# EAGLE design sep_boards_V4 (EAGLE 9.0.1)
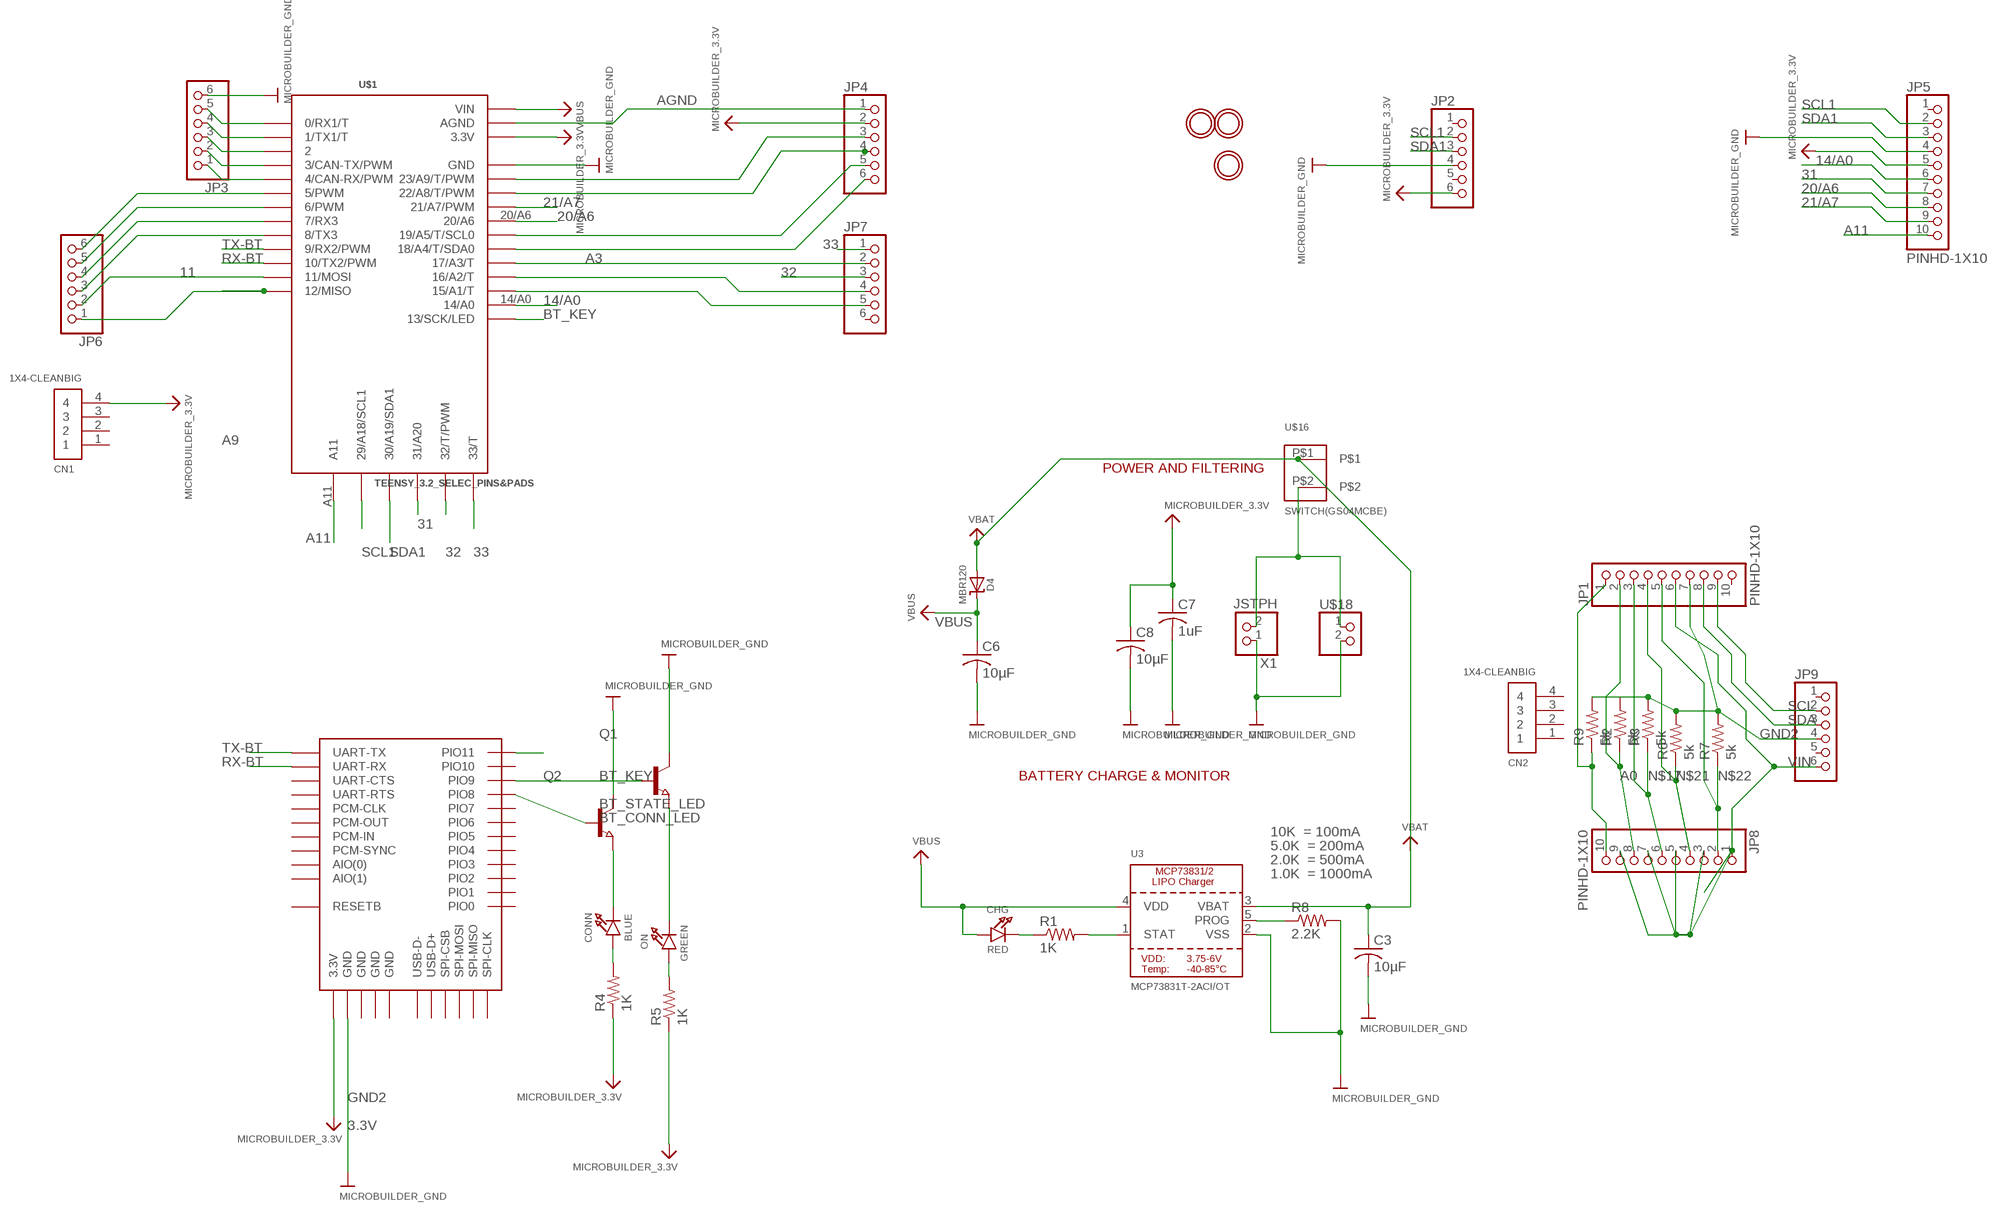
[diagram p0: schematic, sheet 1]

## Parts
C3  10µF  C-USC0805  [C0805]
C6  10µF  C-USC0805  [C0805]
C7  1uF  C-USC0805  [C0805]
C8  10µF  C-USC0805  [C0805]
CHG  RED  LED0805_NOOUTLINE  [CHIPLED_0805_NOOUTLINE]
CN1  1X4-CLEANBIG  [1X04-CLEANBIG]
CN2  1X4-CLEANBIG  [1X04-CLEANBIG]
CONN  BLUE  LED0805_NOOUTLINE  [CHIPLED_0805_NOOUTLINE]
D4  MBR120  DIODE-SCHOTTKYSOD-123  [SOD-123]
JP1  PINHD-1X10  [1X10-BIG]
JP2  PINHD-1X6CLEAN  [1X06-CLEAN]
JP3  PINHD-1X6B  [1X06-BIG]
JP4  PINHD-1X6B  [1X06-BIG]
JP5  PINHD-1X10  [1X10-BIG]
JP6  PINHD-1X6B  [1X06-BIG]
JP7  PINHD-1X6B  [1X06-BIG]
JP8  PINHD-1X10  [1X10-BIG]
JP9  PINHD-1X6CB  [1X06-CLEANBIG]
ON  GREEN  LED0805_NOOUTLINE  [CHIPLED_0805_NOOUTLINE]
Q1  NPN-TRANSISTOR_SOT23  [SOT23]
Q2  NPN-TRANSISTOR_SOT23  [SOT23]
R1  1K  R-US_M0805  [M0805]
R2  5k  R-US_M0805  [M0805]
R3  5k  R-US_M0805  [M0805]
R4  1K  R-US_M0805  [M0805]
R5  1K  R-US_M0805  [M0805]
R6  5k  R-US_M0805  [M0805]
R7  5k  R-US_M0805  [M0805]
R8  2.2K  R-US_M0805  [M0805]
R9  5k  R-US_M0805  [M0805]
U3  MCP73831T-2ACI/OT  MCP73831/2  [SOT23-5]
U$1  TEENSY_3.2_SELEC_PINS&PADS  [TEENSY_3.0-3.2SELEC_PINS&_PADS]
U$2  BTM400_6B  [BTM400_6B]
U$16  SWITCH(GS04MCBE)  [SWITCH(GS04MCBE)]
U$18  PINHD-1X2  [1X02]
U$22  MOUNTINGHOLE2.5  [MOUNTINGHOLE_2.5_PLATED]
U$23  MOUNTINGHOLE2.5  [MOUNTINGHOLE_2.5_PLATED]
U$32  MOUNTINGHOLE2.5  [MOUNTINGHOLE_2.5_PLATED]
X1  JSTPH  CON_JST_PH_2PIN  [JSTPH2]

## Nets
3.3V: C7.1 C8.1 CN1.4 JP2.6 JP4.2 JP5.5 R4.1 R5.1 U$1.3.3V U$2.3.3V ; supply symbol labelled MICROBUILDER_3.3V
11: JP6.2 U$1.11(11/MOSI)
14/A0: JP5.6 U$1.14/A0
20/A6: JP5.8 U$1.20/A6
21/A7: JP5.9 U$1.21/A7(21/A7/PWM)
31: JP5.7 U$1.31(31/A20)
32: JP7.3 U$1.32(32/T/PWM)
33: JP7.1 U$1.33(33/T)
A0: JP1.2 JP8.8 R2.1
A3: JP7.2 U$1.17/A3(17/A3/T)
A8: JP4.4 U$1.22/A8(22/A8/T/PWM)
A9: JP4.3 U$1.23/A9(23/A9/T/PWM)
A11: JP5.10 U$1.A11
AGND: JP4.1 U$1.AGND
BT_CONN_LED: Q2.1(B) U$2.PIO(8)(PIO8)
BT_KEY: U$1.13(13/SCK/LED) U$2.PIO(11)(PIO11)
BT_STATE_LED: Q1.1(B) U$2.PIO(9)(PIO9)
GND2: C3.2 C6.2 C7.2 C8.2 JP1.7 JP2.4 JP3.6 JP5.4 JP9.4 Q1.3(C) Q2.3(C) R2.2 R3.2 R6.2 R7.2 R8.2 R9.2 U3.2(VSS) U$1.GND U$2.GND@1(GND) U$18.2 X1.1 ; supply symbol labelled MICROBUILDER_GND
N$1: CONN.A R4.2
N$2: ON.A R5.2
N$3: JP3.1 U$1.4(4/CAN-RX/PWM)
N$4: JP3.2 U$1.3(3/CAN-TX/PWM)
N$5: ON.C Q1.2(E)
N$6: CONN.C Q2.2(E)
N$7: JP3.3 U$1.2
N$8: JP3.4 U$1.1(1/TX1/T)
N$9: JP3.5 U$1.0(0/RX1/T)
N$10: JP7.4 U$1.16/A2(16/A2/T)
N$11: JP6.6 U$1.5(5/PWM)
N$12: JP6.5 U$1.6(6/PWM)
N$13: JP6.4 U$1.7(7/RX3)
N$14: JP6.3 U$1.8(8/TX3)
N$15: JP6.1 U$1.12(12/MISO)
N$16: JP1.1 JP8.10 R9.1
N$17: JP1.3 JP8.6 R3.1
N$18: JP4.5 U$1.19/A5(19/A5/T/SCL0)
N$19: JP4.6 U$1.18/A4(18/A4/T/SDA0)
N$20: JP7.5 U$1.15/A1(15/A1/T)
N$21: JP1.4 JP8.4 R6.1
N$22: JP1.5 JP8.2 R7.1
N$52: CHG.C R1.1
N$53: R1.2 U3.1(STAT)
N$54: R8.1 U3.5(PROG)
RX-BT: U$1.10(10/TX2/PWM) U$2.UART-RX
SCL: JP1.9 JP9.2
SCL1: JP2.2 JP5.2 U$1.29(29/A18/SCL1)
SDA: JP1.8 JP9.3
SDA1: JP2.3 JP5.3 U$1.30(30/A19/SDA1)
TX-BT: U$1.9(9/RX2/PWM) U$2.UART-TX
VBAT: U$16.P$2 U$18.1 X1.2
VBAT2: C3.1 D4.A U3.3(VBAT) U$16.P$1 ; supply symbol labelled VBAT
VBUS: C6.1 CHG.A D4.C U3.4(VDD) U$1.VIN
VIN: JP1.6 JP8.1 JP8.3 JP8.5 JP8.7 JP8.9 JP9.6
Unconnected: CN1.1 CN1.2 CN1.3 CN2.1 CN2.2 CN2.3 CN2.4 JP1.10 JP2.1 JP2.5 JP5.1 JP7.6 JP9.1 JP9.5 U$2.AIO(0) U$2.AIO(1) U$2.PCM-CLK U$2.PCM-IN U$2.PCM-OUT U$2.PCM-SYNC U$2.PIO(0)(PIO0) U$2.PIO(1)(PIO1) U$2.PIO(2)(PIO2) U$2.PIO(3)(PIO3) U$2.PIO(4)(PIO4) U$2.PIO(5)(PIO5) U$2.PIO(6)(PIO6) U$2.PIO(7)(PIO7) U$2.PIO(10)(PIO10) U$2.RESETB U$2.SPI-CLK U$2.SPI-CSB U$2.SPI-MISO U$2.SPI-MOSI U$2.UART-CTS U$2.UART-RTS U$2.USB-D+ U$2.USB-D-

## Notes on the sheet
- POWER AND FILTERING
- BATTERY CHARGE & MONITOR
- 10K  = 100mA
- 5.0K  = 200mA
- 2.0K  = 500mA
- 1.0K  = 1000mA

## Power pins joined to a net without a drawn wire
GND2: U$2.GND@2(GND) U$2.GND@3(GND) U$2.GND@4(GND)

## Library data of the parts
C3 C6-C8 = adafruit:C-US: CAPACITOR, American symbol
CHG CONN ON = microbuilder:LED: LED 0603 - 0603 Surface Mount Package 2mA: Green LED - Low Power (3.9mcd, 2ma, 1.7Vf) - Digikey: 475-2709-2-ND Orange LED - Low Power (9.8mcd, 2ma, 1.8Vf) - Digikey: 475-1194-2-ND Red LED - Low Power (5mcd, 2ma, 1.8Vf) - Digikey: 475-1195-2-ND Yellow LED - Low Power (7mcd, 2ma, 1.8Vf) - Digikey: 475-1196-2-ND 5mA: Blue LED - Low Power (17mcd, 5ma, 2.9Vf) - Digikey: LNJ937W8CRACT-ND 0805 - 0805 Surface Mount Package 2mA: Red LED (8.8mcd, 2mA, 1.8Vf, Clear) - Low Power [Digikey: 475-2510-1-ND] Green LED (5mcd, 2mA, 1.8Vf, Clear) - Low Power [Digikey: 475-2730-1-ND] Yellow LED (11.3mcd, 2mA, 1.8Vf, Clear) - Low Power [Digikey: 475-2555-1-ND] 20mA: Red LED (104mcd, 20mA, Diffused) - LS R976 [Digikey: 475-1278-6-ND] Red LED (12mcd, 20mA, 2.0Vf, Clear) - APT2012EC [Digikey: 754-1128-1-ND] Green LED (15mcd, 20mA, 2.2Vf, Clear) - APT2012GC [Digikey: 754-1131-1-ND] Orange LED (160mcd, 20mA, 2.1Vf, Clear) - APT2012SECK [Digikey: 754-1130-1-ND] 1206 - 1206 Surface Mount Package Green LED (26mcd, 20mA, Diffused) - LG N971 [Digikey: 475-1407-6-ND] Red LED (15mcd, 20mA, Diffused) - LH N974 [Digikey: 475-1416-6-ND] Cree - Cree High-Power Surface Mount LEDs XPEBWT-L1-0000-00D50 - White 111lm 350mA 2.9Vf 6200K 110° XTEAWT-00-0000-00000LEE3 - White 114lm 350mA 2.85Vf 5000K 115° Everlight - Everlight 45-21 Series Surface Mount LEDs 45-21/QK2C-B2832AC2CB2/2T - Warm White 2000mcd 20mA 3.25Vf 3050K 120° 45-21/LK2C-B38452C4CB2/2T - Nuetral White 2000mcd 20mA 3.25Vf 4150K 120° 45-21/LK2C-B50634C6CB2/2T - Cold White 2200mcd 20mA 3.25Vf 5650K 120° PLCC2 Reverse Mount LS T77K-J1L2-1-0-2-R18-Z - Red 11.25mcd 2mA 1.8Vf 630nm 120° LO T77K-L1M2-24-Z - Orange 19.6mcd 2mA 1.8Vf 606nm 120° LY T77K-K2M1-26-Z - Yellow 15.7mcd 2mA 1.8Vf 587nm 120°
CN1 CN2 = adafruit:1X4: 4-pin connector
D4 = microbuilder:DIODE-SCHOTTKY
JP1 JP5 JP8 = adafruit:PINHD-1X10: Pin header 1x10 0.1" spacing With round pins
JP2-JP4 JP6 JP7 JP9 = adafruit:PINHD-1X6: PIN HEADER
Q1 Q2 = semicon-smd-ipc:NPN-TRANSISTOR_: NPN TRANSISTOR
R1-R9 = adafruit:R-US_: RESISTOR, American symbol
U3 = microbuilder:MCP73831/2: MCP73831/2 LIPO Charger VDD: 3.75 - 6V Temp -40 - 85°C Programmable Charge Rate: 15-500mA NOTE: STAT is a tri-state logic output on the MCP73831 and an open-drain output on the MCP73832. SOT23-5 with 4.2V output and tri-state logic on STAT = MCP73831T-2ACI/OT
U$1 = Teensy_3_and_LC_Series_Boards_v1.4:TEENSY_3.2_SELEC_PINS&PADS
U$2 = bc417:BTM400_6B
U$16 = adafruit:SWITCH(GS04MCBE)
U$18 = pinhead:PINHD-1X2: PIN HEADER
U$22 U$23 U$32 = microbuilder:MOUNTINGHOLE: Mounting Hole For #2 screws (0.086"/2.18mm width, 0.094"/2.4mm hole) use 2.5mm; BOM: EXCLUDE
X1 = microbuilder:CON_JST_PH_2PIN: JST 2-Pin Right-Angle Connector PH-Series - 4UConnector: 17311 SH-Series - 4UConnector: 07278

## Board
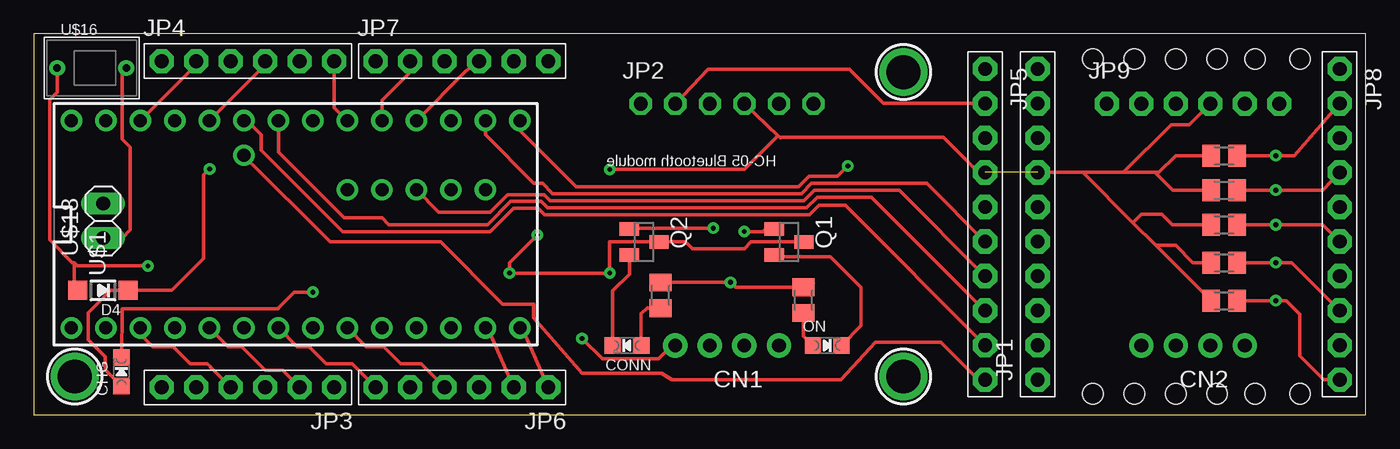
[diagram p1: board, top side]
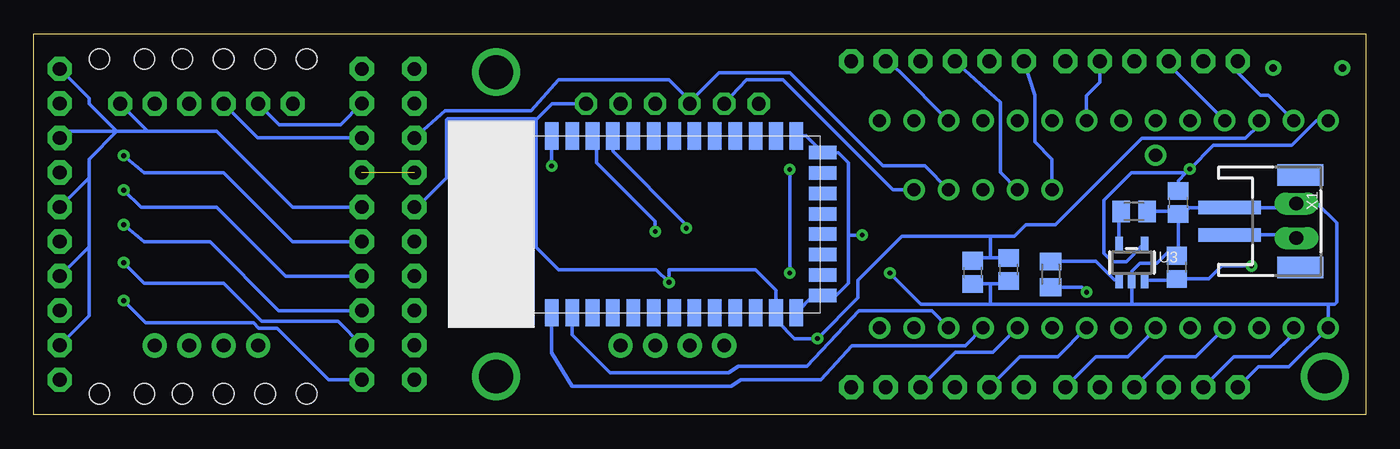
[diagram p2: board, bottom side, seen from below]

Size 98 x 28 mm. Coordinates in mm from the lower left corner, seen from the top.
Outline: 98,0 98,28 0,28 0,0 98,0
Copper layers (1*16): Top 0.035mm / dielectric 1.5mm / Bottom 0.035mm
Design rules "default *": minimum track width 10mil, minimum drill 0.33mm, track to track 10mil, track to pad 10mil, pad to pad 10mil, via to via 10mil, smd to smd 10mil, copper to edge 40mil, drill to drill 6mil, minimum pad ring 12mil, minimum via ring 10mil, stop-mask expansion 4mil, vias tented up to drill 0mil, thermal gap 10mil
Holes 1.5 mm at 77.93,1.52 80.98,1.52 84.03,1.52 87.08,1.52 89.87,1.52 93.17,1.52 93.17,26.16 89.87,26.16 87.08,26.16 84.03,26.16 80.98,26.16 77.93,26.16

### Footprints (pad centres in the part's own frame; a part is rotated, then mirrored left to right if it is on the bottom)
C0805 = smd 1.3 x 1.5: 1 -0.85,0; 2 0.85,0
CHIPLED_0805_NOOUTLINE = smd 1.2 x 1.2: A 0,-1.05; C 0,1.05
1X04-CLEANBIG = drill 1.016 pad 1.778: 1 -3.81,0; 2 -1.27,0; 3 1.27,0; 4 3.81,0
SOD-123 = smd 1.4 x 1.4: A 1.85,0; C -1.85,0
1X10-BIG = drill 1.016 pad 1.778 octagon: 1 -11.43,0; 2 -8.89,0; 3 -6.35,0; 4 -3.81,0; 5 -1.27,0; 6 1.27,0; 7 3.81,0; 8 6.35,0; 9 8.89,0; 10 11.43,0
1X06-CLEAN = drill 1.016 octagon: 1 -6.35,0; 2 -3.81,0; 3 -1.27,0; 4 1.27,0; 5 3.81,0; 6 6.35,0
1X06-BIG = drill 1.016 pad 1.778 octagon: 1 -6.35,0; 2 -3.81,0; 3 -1.27,0; 4 1.27,0; 5 3.81,0; 6 6.35,0
1X06-CLEANBIG = drill 1.016 pad 1.778 octagon: 1 -6.35,0; 2 -3.81,0; 3 -1.27,0; 4 1.27,0; 5 3.81,0; 6 6.35,0
SOT23 = smd 1 x 1.4: 1 -0.95,-1.1; 2 0.95,-1.1; 3 0,1.1
M0805 = smd 1.3 x 1.6: 1 -0.95,0; 2 0.95,0
SOT23-5 = smd 0.55 x 1.2: 1 -0.95,-1.3; 2 0,-1.3; 3 0.95,-1.3; 4 0.95,1.3; 5 -0.95,1.3
TEENSY_3.0-3.2SELEC_PINS&_PADS = drill 0.965: 0 -7.62,13.97; 1 -7.62,11.43; 2 -7.62,8.89; 3 -7.62,6.35; 3.3V 7.62,11.43; 4 -7.62,3.81; 5 -7.62,1.27; 6 -7.62,-1.27; 7 -7.62,-3.81; 8 -7.62,-6.35; 9 -7.62,-8.89; 10 -7.62,-11.43; 11 -7.62,-13.97; 12 -7.62,-16.51; 13 7.62,-16.51; 14/A0 7.62,-13.97; 15/A1 7.62,-11.43; 16/A2 7.62,-8.89; 17/A3 7.62,-6.35; 18/A4 7.62,-3.81; 19/A5 7.62,-1.27; 20/A6 7.62,1.27; 21/A7 7.62,3.81; 22/A8 7.62,6.35; 23/A9 7.62,8.89; 29 2.54,-13.97; 30 2.54,-11.43; 31 2.54,-8.89; 32 2.54,-6.35; 33 2.54,-3.81; A11 5.08,3.81; AGND 7.62,13.97; GND -7.62,16.51; VIN 7.62,16.51
BTM400_6B = smd 2 x 1: 3.3V -6.5,-10.16; AIO(0) -6.5,-5.66; AIO(1) -6.5,-7.16; GND@1 -6.5,-11.66; GND@4 6.5,-11.66; PCM-CLK -6.5,0.34; PCM-IN -6.5,-2.66; PCM-OUT -6.5,-1.16; PCM-SYNC -6.5,-4.16; PIO(0) 6.5,-10.16; PIO(1) 6.5,-8.66; PIO(2) 6.5,-7.16; PIO(3) 6.5,-5.66; PIO(4) 6.5,-4.16; PIO(5) 6.5,-2.66; PIO(6) 6.5,-1.16; PIO(7) 6.5,0.34; PIO(8) 6.5,1.84; PIO(9) 6.5,3.34; PIO(10) 6.5,4.84; PIO(11) 6.5,6.34; RESETB -6.5,-8.66; UART-CTS -6.5,3.34; UART-RTS -6.5,1.84; UART-RX -6.5,4.84; UART-TX -6.5,6.34 | smd 1 x 2: GND@2 -5.23,-13.6; GND@3 5.27,-13.6; SPI-CLK 2.27,-13.6; SPI-CSB -2.23,-13.6; SPI-MISO 0.77,-13.6; SPI-MOSI -0.73,-13.6; USB-D+ 3.77,-13.6; USB-D- -3.73,-13.6
SWITCH(GS04MCBE) = drill 0.55: P$1 0,-2.54; P$2 0,2.54
1X02 = drill 1.016 long: 1 -1.27,0; 2 1.27,0
MOUNTINGHOLE_2.5_PLATED = drill 2.5 pad 3.2: P$1 0,0
JSTPH2 = smd 1 x 4.6: 1 -1,-3.7; 2 1,-3.7 | smd 1.6 x 3.4: NC1 -3.4,1.5; NC2 3.4,1.5

### Placement (x,y rotation side)
C3  13.89,10.83 90 bottom
C6  13.78,15.6 270 bottom
C7  28.91,10.46 270 bottom
C8  26.27,10.68 270 bottom
CHG  6.44,3.14 0 top
CN1  51.01,5.08 180 top
CN2  85.3,5.08 180 top
CONN  43.64,5.08 90 top
D4  5.08,9.14 180 top
JP1  73.87,14 90 top
JP2  51.01,22.86 0 top
JP3  15.75,2 180 top
JP4  15.75,26 0 top
JP5  70,14 270 top
JP6  31.5,2 180 top
JP7  31.5,26 0 top
JP8  96.09,14 270 top
JP9  85.3,22.86 0 top
ON  58.38,5.08 270 top
Q1  55.58,12.7 270 top
Q2  44.91,12.7 270 top
R1  23.18,10.32 90 bottom
R2  87.59,11.18 180 top
R3  87.59,13.97 180 top
R4  46.1,8.78 270 top
R5  56.64,8.42 270 top
R6  87.59,16.51 180 top
R7  87.59,19.05 180 top
R8  17.03,14.94 0 bottom
R9  87.59,8.38 180 top
U3  17.2,11.18 0 bottom
U$1  19.26,14 90 top
U$2  53.55,14 90 bottom
U$16  4.25,25.5 270 top
U$18  5.09,14.25 90 top
U$22  64,25.2 90 top
U$23  64,2.8 270 top
U$32  3,2.8 90 top
X1  6.31,14.22 270 bottom

### Tracks (layer width: path | path; a pad name or v marks a point on that pad's centre or on a via)
3.3V  (via drill 0.35)
  Top 0.254: R4.1 v51.26,9.73 51.62,9.37 R5.1 56.92,9.65 57.36,9.65 57.29,9.73 | CN1.4 46.94,5.08 45.96,4.1 41.83,4.1 v40.34,5.59 | U$1.3.3V 11.94,25.73 JP4.2
  Bottom 0.254: 43,6.6 43.39,6.6 43.39,6.86 | 43.39,6.86 U$2.3.3V 43.39,9.14 44.91,10.67 51.26,10.67 v51.26,9.73 52.21,10.67 59.39,10.67 61.04,12.32 61.04,21.67 | 28.61,11.31 C7.1 28.7,11.53 27.62,11.53 | 26.48,11.31 C8.1 27.62,11.53 | U$1.3.3V 7.83,21.34 8.85,20.32 16.47,20.32 22.82,13.97 25,13.97 25.84,13.12 27.62,13.12 | JP2.6 59.86,22.86 61.04,21.67 | 61.04,21.67 61.12,21.75 67.57,21.75 67.65,21.67 67.65,17.41 69.79,15.27 JP5.5 | 43.39,6.86 43.29,6.86 42.02,5.59 v40.34,5.59 37.34,8.59 37.34,9.89 34.1,13.12 27.62,13.12 | 27.62,11.53 27.62,13.12
  Bottom 0.305: U$2.3.3V 43.39,8.38
11
  Top 0.254: JP6.2 33.48,6.13 U$1.11
14/A0
  Top 0.254: U$1.14/A0 33.23,20.57 36.79,17.02 37.42,17.02 38.18,16.26 56.48,16.26 57.24,17.02 65.71,17.02 JP5.6
20/A6
  Top 0.254: U$1.20/A6 17.99,19.3 22.82,14.48 25.61,14.48 26.12,13.97 33.37,13.97 35.08,15.68 37.32,15.68 37.79,15.21 56.87,15.21 57.66,16 61.65,16 JP5.8
21/A7
  Top 0.254: U$1.21/A7 15.67,21.62 16.72,20.57 16.72,19.46 22.72,13.46 33.58,13.46 35.29,15.17 37.11,15.17 37.58,14.7 57.08,14.7 57.76,15.38 59.73,15.38 JP5.9
31
  Top 0.254: U$1.31 29.8,14.89 33.58,14.89 34.87,16.18 37.53,16.18 37.97,15.75 56.69,15.75 57.45,16.51 63.68,16.51 JP5.7
32
  Bottom 0.254: U$1.32 26.88,17.81 26.88,22.98 JP7.3
33
  Bottom 0.254: U$1.33 23.07,18.8 24.34,20.07 24.34,23.48 JP7.1
A0  (via drill 0.35)
  Top 0.254: JP8.8 92.57,11.18 v91.4,11.18 R2.1
  Bottom 0.254: v91.4,11.18 89.87,9.65 84.03,9.65 81.24,6.86 75.62,6.86 JP1.2
A3
  Top 0.254: U$1.17/A3 25.61,23.11 27.69,25.19 JP7.2
A8
  Top 0.254: U$1.22/A8 17.02,25.73 JP4.4
A9
  Bottom 0.254: JP4.3 14.48,25.73 U$1.23/A9
A11
  Top 0.254: JP5.10 69.52,2.57 66.76,5.33 61.93,5.33 59.39,2.54 46.95,2.54 46.18,3.06 40.34,3.06 36.79,7.11 36.79,8.13 34.5,8.13 29.93,12.7 21.8,12.7 15.45,19.05 U$1.A11
AGND
  Bottom 0.254: U$1.AGND 7.17,23.5 7.75,23.5 9.4,25.15 JP4.1
BT_CONN_LED  (via drill 0.35)
  Top 0.254: Q2.1 44.13,13.97 44.39,13.72 v49.99,13.72
  Bottom 0.254: U$2.PIO(8) 55.39,19.37 49.99,13.97 v49.99,13.72
BT_KEY  (via drill 0.35)
  Top 0.254: v59.9,18.29 59.14,17.53 57.03,17.53 56.26,16.76 39.9,16.76 35.77,20.89 U$1.13
  Bottom 0.254: v59.9,18.29 U$2.PIO(11)
BT_STATE_LED  (via drill 0.35)
  Top 0.254: Q1.1 arc90 54.16,13.97 53.65,13.46 v52.28,13.46
  Bottom 0.254: U$2.PIO(9) 56.6,20.21 56.6,18.54 52.28,14.22 v52.28,13.46
GND2  (via drill 0.35)  (1 unrouted)
  Top 0.254: Q2.3 45.92,12.79 45.42,12.79 | 54.93,20.35 54.89,20.38 | 54.89,20.38 54.76,20.51 | 54.76,20.51 JP2.4 | Q1.3 52.79,12.7 52.28,12.19 48.47,12.19 47.96,12.7 Q2.3 | Q2.3 42.37,12.7 v42.37,10.41 v35.01,10.41 35.01,11.18 v37.04,13.21 | 54.76,20.51 52.28,18.03 v42.37,18.03 | 54.89,20.38 66.95,20.38 69.52,17.81 JP5.4 | JP1.7 77.21,17.81 | 77.21,17.81 80.19,17.81 | 80.19,17.81 83.72,21.34 85.05,21.34 JP9.4 | R7.2 84.03,19.05 82.79,17.81 82.51,17.81 | 82.51,17.81 80.19,17.81 | R9.2 82.57,12.45 | 82.57,12.45 80.89,14.13 | 80.89,14.13 77.21,17.81 | R2.2 85.3,11.18 84.03,12.45 82.57,12.45 | R3.2 83.78,13.97 83.01,14.73 81.49,14.73 80.89,14.13 | R6.2 83.81,16.51 82.51,17.81
  Bottom 0.254: U$2.GND@1 40.62,8.77 U$2.GND@2 38.94,8.77 38.06,9.65 38.06,13.21 | U$2.GND@4 41.18,20.5 U$2.GND@3 38.78,19.27 38.06,18.54 38.06,13.21 | v42.37,18.03 v42.37,10.41 | 38.06,13.21 v37.04,13.21 | v35.01,10.41 32.72,8.13 27.62,8.13 | 14.4,11.18 C3.2 13.78,11.79 | C6.2 12.98,15.22 X1.1 5.39,15.22 U$18.2 3.54,15.52 2.12,14.11 2.12,8.25 2.25,8.13 2.75,8.13 | R8.2 13.97,14.94 C6.2 | C6.2 13.78,11.79 | C7.2 27.62,9.61 | 27.62,9.61 26.48,9.61 C8.2 | JP3.6 7.9,3.5 5.63,3.5 U$1.GND 2.75,8.13 | 27.62,8.13 17.12,8.13 | 17.12,8.13 2.75,8.13 | 27.62,9.61 27.62,8.13 | 17.12,8.13 17.2,8.21 U3.2 17.2,10.55 16.62,11.12 15.38,11.12 14.62,11.88 13.87,11.88 13.78,11.79
N$1
  Top 0.254: CONN.A 44.69,7.4 45.17,7.87 45.22,7.83 R4.2
N$2
  Top 0.254: 56.82,7.29 R5.2 56.64,5.77 ON.A
N$3
  Bottom 0.254: JP3.1 19.85,4.25 17.5,4.25 15.45,6.3 U$1.4
N$4
  Top 0.254: U$1.3 14.29,5 15.27,5 17,3.27 18.29,3.27 JP3.2
N$5
  Top 0.254: Q1.2 54.5,11.75 54.62,11.62 58.62,11.62 60.88,9.38 60.88,6.53 ON.C
N$6
  Top 0.254: Q2.2 43.81,10.33 42.59,9.11 CONN.C
N$7
  Bottom 0.254: JP3.3 14.77,4.25 12.5,4.25 U$1.2
N$8
  Top 0.254: JP3.4 13,3.48 13,3.5 12.75,3.75 11.5,3.75 10.25,5 8.75,5 7.83,5.92 U$1.1
N$9
  Bottom 0.254: JP3.5 9.69,4.25 7,4.25 5.29,5.96 U$1.0
N$10
  Top 0.254: U$1.16/A2 31.77,25.24 JP7.4
N$11
  Top 0.254: JP6.6 23.4,3.75 21.5,3.75 20.25,5 19.37,5 U$1.5
N$12
  Bottom 0.254: JP6.5 25.44,4.25 22.66,4.25 U$1.6
N$13
  Top 0.254: JP6.4 28.48,3.75 27,3.75 25.75,5 24.45,5 U$1.7
N$14
  Bottom 0.254: JP6.3 30.2,4.57 27.43,4.57 U$1.8
N$15
  Top 0.254: JP6.1 36.02,6.13 U$1.12
N$16  (via drill 0.35)
  Top 0.254: R9.1 v91.4,8.38 92.16,8.38 93.17,7.37 93.17,4.32 94.92,2.57 JP8.10
  Bottom 0.254: v91.4,8.38 91.4,8.13 | v91.4,8.38 91.4,8.64 | v91.4,8.38 89.76,6.75 81.85,6.75 81.45,6.35 80.1,6.35 77.17,3.42 77.15,3.42 76.3,2.57 JP1.1
N$17  (via drill 0.35)
  Top 0.254: JP8.6 94.86,13.97 v91.4,13.97 R3.1
  Bottom 0.254: v91.4,13.97 89.87,12.7 85.05,12.7 80,7.65 JP1.3
N$18
  Bottom 0.254: JP4.5 19.56,24.44 20.53,23.47 U$1.19/A5
N$19
  Top 0.254: U$1.18/A4 22.1,22.59 JP4.6
N$20
  Bottom 0.254: U$1.15/A1 34.31,25.24 JP7.5
N$21  (via drill 0.35)
  Top 0.254: JP8.4 94.86,16.51 v91.4,16.51 R6.1
  Bottom 0.254: v91.4,16.51 90.13,15.24 84.54,15.24 79.49,10.19 JP1.4
N$22  (via drill 0.35)
  Top 0.254: JP8.2 92.76,19.05 v91.4,19.05 R7.1
  Bottom 0.254: v91.4,19.05 89.87,17.78 84.03,17.78 78.98,12.73 JP1.5
N$52  (via drill 0.35)
  Top 0.254: 17.99,7.87 18.15,8 | 18.15,8 17.96,7.8 6.48,7.8 CHG.C | 18.15,8 19.16,9.01 v20.52,9.01
  Bottom 0.254: v20.52,9.01 20.88,9.37 R1.1
N$53
  Bottom 0.254: U3.1 18.18,9.91 18.5,9.91 19.86,11.27 R1.2
N$54
  Bottom 0.254: U3.5 18.15,14.77 R8.1
RX-BT
  Bottom 0.254: U$1.10 31.93,7.62 37.29,7.62 41.1,3.56 46.16,3.56 46.9,3.07 55.61,3.07 58.39,5.86 U$2.UART-RX
SCL
  Bottom 0.254: JP9.2 79.97,21.34 75.42,21.34 JP1.9
SCL1
  Top 0.254: JP2.2 49.6,25.4 60,25.4 62.51,22.89 JP5.2
  Bottom 0.254: U$1.29 34.78,16.54 42.88,24.64 45.56,24.64 JP2.2
  Bottom 0.305: 46.95,23.25 JP2.2
SDA
  Bottom 0.254: JP1.8 81.52,20.35 JP9.3
SDA1
  Bottom 0.254: JP2.3 49.68,23.06 | U$1.30 32.44,18.29 35.52,18.29 42.37,25.15 45.36,25.15 45.37,25.15 45.57,25.15 47.59,25.15 49.68,23.06 | 49.68,23.06 51.26,24.64 59.39,24.64 61.43,22.35 67.75,22.35 JP5.3
TX-BT
  Bottom 0.254: U$2.UART-TX 59.89,4.56 58.39,2.07 46.68,2.07 45.95,2.55 40.08,2.55 37.8,5.08 29.45,5.08 U$1.9
VBAT
  Top 0.254: U$18.1 6.48,12.98 7.1,13.6 7.1,19.65 6.5,20.25 6.5,25.21 U$16.P$2
  Bottom 0.254: X1.2 5.33,13.22 U$18.1
VBAT2  (via drill 0.35)
  Top 0.254: U$16.P$1 1.71,23.71 1.14,23.14 1.14,12.86 2.83,11.17 2.95,11.17 | v8.39,10.93 3.19,10.93 2.95,11.17 | D4.A 2.95,9.42 2.95,11.17
  Bottom 0.254: U3.3 13.99,9.88 C3.1 11.52,9.98 10.57,10.93 v8.39,10.93
VBUS  (via drill 0.35)
  Top 0.254: v12.94,18.06 12.51,17.63 12.51,11.51 10.14,9.14 D4.C 5.64,9.14 4,7.5 4,5.5 5.25,4.25 5.25,3.28 CHG.A
  Bottom 0.254: U3.4 16.38,12.48 17.62,11.25 18.62,11.25 19.25,11.88 19.25,15.78 17.25,17.78 13.22,17.78 | U$1.VIN 3.64,21.62 5.45,19.81 11.19,19.81 v12.94,18.06 13.22,17.78 | 13.22,17.78 13.78,17.22 C6.1
VIN
  Bottom 0.254: JP1.6 78.98,15.27 84.54,20.83 89.62,20.83 | 89.62,20.83 JP9.6 | 89.62,20.83 91.9,20.83 | 91.9,20.83 93.94,22.86 93.94,23.27 JP8.1 | 91.9,20.83 95.62,20.83 JP8.3 | JP8.5 93.94,17.43 | 93.94,17.43 93.94,18.8 91.9,20.83 | JP8.7 93.94,12.35 | 93.94,12.35 93.94,17.43 | JP8.9 93.94,7.27 93.94,12.35